# Altium project MC3_r2.PrjPcb (part 5 of 10)

## Sheet AD_Sensors.SchDoc
size Letter; DocumentNumber: D_11; SheetNumber: 11; SheetTotal: 21
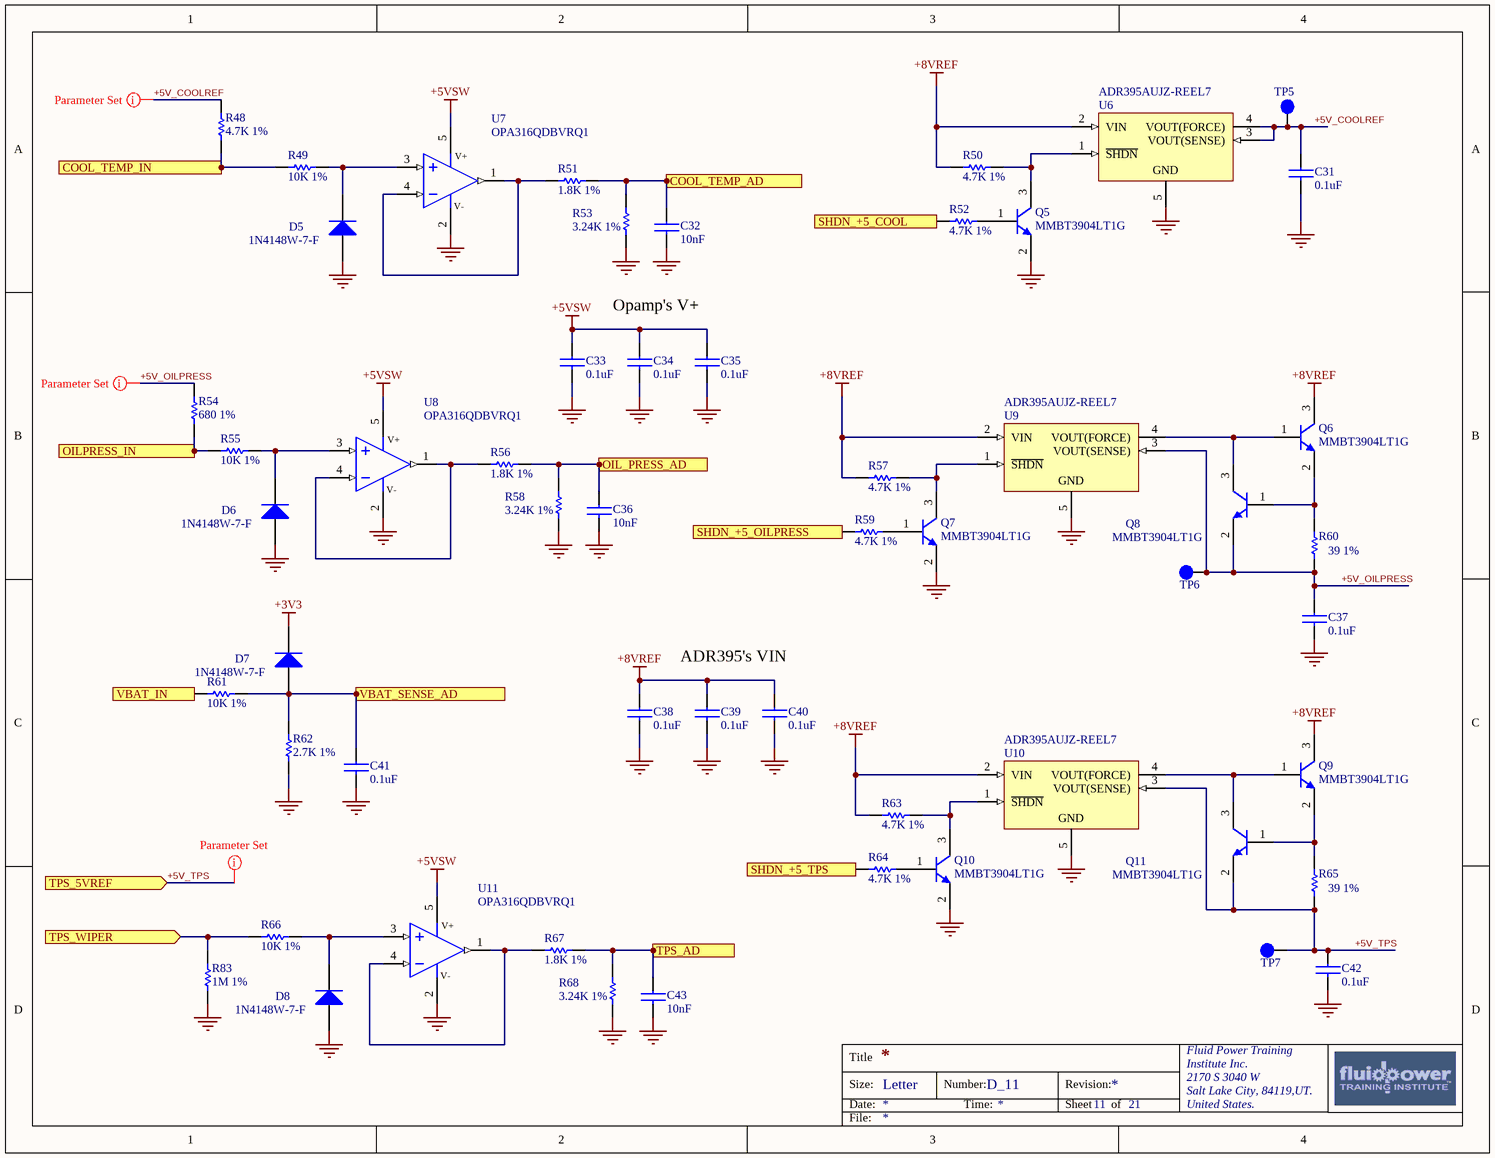
[diagram p8: AD_Sensors.SchDoc]

### Parts
C31  0.1uF  [C0805]
C32  10nF  [C0805]
C33  0.1uF  [C0805]
C34  0.1uF  [C0805]
C35  0.1uF  [C0805]
C36  10nF  [C0805]
C37  0.1uF  [C0805]
C38  0.1uF  [C0805]
C39  0.1uF  [C0805]
C40  0.1uF  [C0805]
C41  0.1uF  [C0805]
C42  0.1uF  [C0805]
C43  10nF  [C0805]
D5  1N4148W-7-F  [DIOD-SOD123-2_V]
D6  1N4148W-7-F  [DIOD-SOD123-2_V]
D7  1N4148W-7-F  [DIOD-SOD123-2_V]
D8  1N4148W-7-F  [DIOD-SOD123-2_V]
Q5  MMBT3904LT1G  [ONSC-SOT-23-3-318-08_V]
Q6  MMBT3904LT1G  [ONSC-SOT-23-3-318-08_V]
Q7  MMBT3904LT1G  [ONSC-SOT-23-3-318-08_V]
Q8  MMBT3904LT1G  [ONSC-SOT-23-3-318-08_V]
Q9  MMBT3904LT1G  [ONSC-SOT-23-3-318-08_V]
Q10  MMBT3904LT1G  [ONSC-SOT-23-3-318-08_V]
Q11  MMBT3904LT1G  [ONSC-SOT-23-3-318-08_V]
R48  4.7K 1%  [R0805]
R49  10K 1%  [R0805]
R50  4.7K 1%  [R0805]
R51  1.8K 1%  [R0805]
R52  4.7K 1%  [R0805]
R53  3.24K 1%  [R0805]
R54  680 1%  [R0805]
R55  10K 1%  [R0805]
R56  1.8K 1%  [R0805]
R57  4.7K 1%  [R0805]
R58  3.24K 1%  [R0805]
R59  4.7K 1%  [R0805]
R60  39 1%  [R0805]
R61  10K 1%  [R0805]
R62  2.7K 1%  [R0805]
R63  4.7K 1%  [R0805]
R64  4.7K 1%  [R0805]
R65  39 1%  [R0805]
R66  10K 1%  [R0805]
R67  1.8K 1%  [R0805]
R68  3.24K 1%  [R0805]
R83  1M 1%  [R0805]
TP5  T  [TESTPOINTSMD_1x1MM]  (value not drawn)  (no BOM)
TP6  T  [TESTPOINTSMD_1x1MM]  (value not drawn)  (no BOM)
TP7  T  [TESTPOINTSMD_1x1MM]  (value not drawn)  (no BOM)
U6  ADR395AUJZ-REEL7  [ADI-UJ-5_M]
U7  OPA316QDBVRQ1  [DBV0005A_M]
U8  OPA316QDBVRQ1  [DBV0005A_M]
U9  ADR395AUJZ-REEL7  [ADI-UJ-5_M]
U10  ADR395AUJZ-REEL7  [ADI-UJ-5_M]
U11  OPA316QDBVRQ1  [DBV0005A_M]

### Ports
COOL_TEMP_AD (out), COOL_TEMP_IN (in), OIL_PRESS_AD (out), OILPRESS_IN (in), SHDN_+5_COOL (in), SHDN_+5_OILPRESS (in), SHDN_+5_TPS (in), TPS_5VREF (in), TPS_AD (out), TPS_WIPER (in), VBAT_IN (in), VBAT_SENSE_AD (out)

### Nets
+3V3: D7.2(K)
+5VSW: C33.1 C34.1 C35.1 U7.5(V+) U8.5(V+) U11.5(V+)
+8VREF: C38.1 C39.1 C40.1 Q6.3(C) Q9.3(C) R50.1 R57.1 R63.1 U6.2(VIN) U9.2(VIN) U10.2(VIN)
GND: C31.2 C32.2 C33.2 C34.2 C35.2 C36.2 C37.2 C38.2 C39.2 C40.2 C41.2 C42.2 C43.2 D5.1(A) D6.1(A) D8.1(A) Q5.2(E) Q7.2(E) Q10.2(E) R53.1 R58.1 R62.1 R68.1 R83.1 U6.5(GND) U7.2(V-) U8.2(V-) U9.5(GND) U10.5(GND) U11.2(V-)
+5V_COOLREF: C31.1 R48.2 TP5.1 U6.3(VOUT(SENSE)) U6.4(VOUT(FORCE))  [project net +5V_COOLREF_11]
+5V_OILPRESS: C37.1 Q8.2(E) R54.2 R60.1 TP6.1 U9.3(VOUT(SENSE))  [project net +5V_OILPRESS_11]
+5V_TPS: C42.1 Q11.2(E) R65.1 TP7.1 U10.3(VOUT(SENSE)) ; port TPS_5VREF  [project net TPS_5VREF]
COOL_AD: C32.1 R51.2 R53.2 ; port COOL_TEMP_AD
COOL_TEMP_IN: R48.1 R49.1 ; port COOL_TEMP_IN
OIL_PRESS_IN: R54.1 R55.1 ; port OILPRESS_IN
OILPRESSAD: C36.1 R56.2 R58.2 ; port OIL_PRESS_AD
SHDN_COOL: R52.1 ; port SHDN_+5_COOL
SHDN_OIL: R59.1 ; port SHDN_+5_OILPRESS
SHDN_TPS: R64.1 ; port SHDN_+5_TPS
TPS_WIPER: R66.1 R83.2 ; port TPS_WIPER
TPSAD: C43.1 R67.2 R68.2 ; port TPS_AD
VBATS_AD: C41.1 D7.1(A) R61.2 R62.2 ; port VBAT_SENSE_AD
VBATT_: R61.1 ; port VBAT_IN
NetD5_2: D5.2(K) R49.2 U7.3(IN+)
NetD6_2: D6.2(K) R55.2 U8.3(IN+)
NetD8_2: D8.2(K) R66.2 U11.3(IN+)
NetQ5_1: Q5.1(B) R52.2
NetQ5_3: Q5.3(C) R50.2 U6.1(~{SHDN})
NetQ6_1: Q6.1(B) Q8.3(C) U9.4(VOUT(FORCE))
NetQ6_2: Q6.2(E) Q8.1(B) R60.2
NetQ7_1: Q7.1(B) R59.2
NetQ7_3: Q7.3(C) R57.2 U9.1(~{SHDN})
NetQ9_1: Q9.1(B) Q11.3(C) U10.4(VOUT(FORCE))
NetQ9_2: Q9.2(E) Q11.1(B) R65.2
NetQ10_1: Q10.1(B) R64.2
NetQ10_3: Q10.3(C) R63.2 U10.1(~{SHDN})
NetR51_1: R51.1 U7.1(OUT) U7.4(IN-)
NetR56_1: R56.1 U8.1(OUT) U8.4(IN-)
NetR67_1: R67.1 U11.1(OUT) U11.4(IN-)

### Layout directives
net class VREF: +5V_COOLREF_11, +5V_OILPRESS_11, TPS_5VREF

### Notes on the sheet
- Opamp's V+
- ADR395's VIN
- Title
- Size:
- Date:
- Letter
- Number:
- Time:
- Revision:
- Sheet
- of
- Fluid Power Training
- Institute Inc.
- 2170 S 3040 W
- Salt Lake City, 84119,UT.
- United States.
- File:

### Library data of the parts
C31 C33-C35 C37-C42 = C0805C104K5RACTU: Cap Ceramic 0.1uF 50V X7R 10% SMD 2.0 x 1.2 mm 125 C Paper T/R; Manufacturer: KEMET; Capacitance: 100nF; Voltage: 500V; Supplier 1: Mouser; Supplier Part Number 1: 80-C0805C104K5R; Manufacturer Part Number: C0805C104K5RACTU; RoHS: Yes; Category: Ceramic Capacitors; Stock 1: 4177670; Pricing 1: 1=0.17000, 10=0.10400, 100=0.05600, 500=0.03900, 1000=0.03200, 4000=0.02400 (USD); Mount: Surface Mount,PCB; Case/Package: 0805; Number of Pins: 2; Case Code (Imperial): 0805; Case Code (Metric): 2012; Dielectric Material: Ceramic; Contact Plating: Tin,Matte; Min Operating Temperature: -55°C; Max Operating Temperature: 125°C; Voltage Rating: 50V; Tolerance: 10%; Packaging: Tape and Reel; Dielectric: X7R; Package Quantity: 4000; Voltage Rating (DC): 50V; Termination: SMD/SMT; Length: 2mm; Height: 0.9mm; Width: 1.2mm; Depth: 1.25mm; Thickness: 0.035inch; Lead Pitch: 0.75mm; Radiation Hardening: No; REACH SVHC: No SVHC; ComponentLink1URL: https://datasheet.ciiva.com/14589/70095383-14589048.pdf?src-supplier=Allied+Electronics; ComponentLink1Description: https://datasheet.ciiva.com/14589/70095383-14589048.pdf?src-supplier=Allied+Electronics; ComponentLink2URL: https://datasheet.ciiva.com/28682/1851736-28682232.pdf?src-supplier=Element14; ComponentLink2Description: https://datasheet.ciiva.com/28682/1851736-28682232.pdf?src-supplier=Element14; ComponentLink3URL: https://datasheet.ciiva.com/32431/slceramic-chip-condensers-e-32431755.pdf?src-supplier=Distrelec; ComponentLink3Description: https://datasheet.ciiva.com/32431/slceramic-chip-condensers-e-32431755.pdf?src-supplier=Distrelec; ComponentLink4URL: https://datasheet.ciiva.com/18410/70095383-18410815.pdf?src-supplier=Allied+Electronics; ComponentLink4Description: https://datasheet.ciiva.com/18410/70095383-18410815.pdf?src-supplier=Allied+Electronics
C32 C36 C43 = CC0805KRX7R9BB103: YAGEO - CC0805KRX7R9BB103 - SMD Multilayer Ceramic Capacitor, 10000 pF, 50 V, 0805 [2012 Metric], ± 10%, X7R, CC Series; Voltage Rating: 50V; Insulation Resistance: 100GR; Supplier 1: Mouser; Supplier Part Number 1: 603-CC805KRX7R9BB103; Manufacturer: Yageo; Manufacturer Part Number: CC0805KRX7R9BB103; RoHS: Yes; Category: Ceramic Capacitors; Stock 1: 473100; Pricing 1: 1=0.11000, 10=0.05700, 100=0.02600, 1000=0.02100, 4000=0.01600, 8000=0.01400 (USD); Mount: Surface Mount; Case/Package: 0805; Number of Pins: 2; Case Code (Imperial): 0805; Case Code (Metric): 2012; Material: Ceramic; Min Operating Temperature: -55°C; Max Operating Temperature: 125°C; Packaging: Tape and Reel; Capacitance: 10nF; Tolerance: 10%; Package Quantity: 1; Dielectric: X7R; Termination: SMD/SMT; Voltage Rating (DC): 50V; Voltage: 50V; Composition: Ceramic; Length: 2mm; Height: 0.6mm; Width: 1.25mm; Depth: 1.25mm; Thickness: 0.024inch; Radiation Hardening: No; REACH SVHC: No SVHC; Lead Free: Lead Free; Halogen Free: Halogen Free; ComponentLink1URL: https://datasheet.ciiva.com/11786/0900766b80d84f1d-11786119.pdf?src-supplier=RSComponents; ComponentLink1Description: https://datasheet.ciiva.com/11786/0900766b80d84f1d-11786119.pdf?src-supplier=RSComponents; ComponentLink2URL: https://datasheet.ciiva.com/25613/0900766b8027bcf6-25613113.pdf?src-supplier=RSComponents; ComponentLink2Description: https://datasheet.ciiva.com/25613/0900766b8027bcf6-25613113.pdf?src-supplier=RSComponents; ComponentLink3URL: https://datasheet.ciiva.com/144/mlccorderingcode-144533.pdf?src-supplier=Digi-Key; ComponentLink3Description: https://datasheet.ciiva.com/144/mlccorderingcode-144533.pdf?src-supplier=Digi-Key; ComponentLink4URL: https://datasheet.ciiva.com/144/mlccorderingcode-144534.pdf?src-supplier=Digi-Key; ComponentLink4Description: https://datasheet.ciiva.com/144/mlccorderingcode-144534.pdf?src-supplier=Digi-Key; ComponentLink5URL: https://datasheet.ciiva.com/46372/1784427-46372638.pdf?src-supplier=Element14; ComponentLink5Description: https://datasheet.ciiva.com/46372/1784427-46372638.pdf?src-supplier=Element14; ComponentLink6URL: https://datasheet.ciiva.com/144/mlccorderingcode-144532.pdf?src-supplier=Digi-Key; ComponentLink6Description: https://datasheet.ciiva.com/144/mlccorderingcode-144532.pdf?src-supplier=Digi-Key; ComponentLink7URL: https://datasheet.ciiva.com/16625/upy-gphc-x7r-6-3v-to-50v-8-16625548.pdf?src-supplier=Avnet+Europe; ComponentLink7Description: https://datasheet.ciiva.com/16625/upy-gphc-x7r-6-3v-to-50v-8-16625548.pdf?src-supplier=Avnet+Europe; ComponentLink8URL: https://datasheet.ciiva.com/22749/1489800-22749215.pdf?src-supplier=Element14; ComponentLink8Description: https://datasheet.ciiva.com/22749/1489800-22749215.pdf?src-supplier=Element14; ComponentLink9URL: https://datasheet.ciiva.com/46372/1734573-46372639.pdf?src-supplier=Element14; ComponentLink9Description: https://datasheet.ciiva.com/46372/1734573-46372639.pdf?src-supplier=Element14
D5-D8 = 1N4148W-7-F: DIODE GEN PURP 100V 300MA SOD123; Manufacturer: Diodes; Reverse Recovery Time: 4ns; Forward Voltage: 1.25V; Element Configuration: Single; Forward Current: 150mA; Peak Non-Repetitive Surge Current: 2A; Power Dissipation: 400mW; Peak Reverse Current: 1uA; Polarity: Standard; Voltage Rating (DC): 75V; Capacitance: 2pF; Current: 15A; Supplier 1: Mouser; Supplier Part Number 1: 621-1N4148W-F; Manufacturer Part Number: 1N4148W-7-F; RoHS: Yes; Category: Rectifier Diodes; Stock 1: 1274151; Pricing 1: 1=0.16000, 10=0.15000, 100=0.05300, 1000=0.03500, 3000=0.02700, 9000=0.02400 (USD); Mount: Surface Mount; Number of Pins: 2; Weight: 0.000353oz; Contact Plating: Tin,Matte; Min Operating Temperature: -65°C; Max Operating Temperature: 150°C; Packaging: Tape and Reel; Max Repetitive Reverse Voltage (Vrrm): 100V; Package Quantity: 3000; Average Rectified Current: 300mA; Max Reverse Voltage (DC): 100V; Recovery Time: 4ns; Max Forward Surge Current (Ifsm): 2A; Max Surge Current: 2A; Current Rating: 150mA; Output Current: 150mA; Voltage: 100V; Power Rating: 400mW; Length: 2.85mm; Height: 1.25mm; Width: 1.7mm; Radiation Hardening: No; Lead Free: Lead Free; REACH SVHC: No SVHC; ComponentLink1URL: https://datasheet.ciiva.com/4435/ds30086-4435128.pdf?src-supplier=Mouser; ComponentLink1Description: https://datasheet.ciiva.com/4435/ds30086-4435128.pdf?src-supplier=Mouser; ComponentLink2URL: https://datasheet.ciiva.com/8300/ds30086-8300392.pdf?src-supplier=Avnet; ComponentLink2Description: https://datasheet.ciiva.com/8300/ds30086-8300392.pdf?src-supplier=Avnet; ComponentLink3URL: https://datasheet.ciiva.com/911/ds30086-911734.pdf?src-supplier=Digi-Key; ComponentLink3Description: https://datasheet.ciiva.com/911/ds30086-911734.pdf?src-supplier=Digi-Key; ComponentLink4URL: https://datasheet.ciiva.com/911/ds30086-911735.pdf?src-supplier=Digi-Key; ComponentLink4Description: https://datasheet.ciiva.com/911/ds30086-911735.pdf?src-supplier=Digi-Key; ComponentLink5URL: https://datasheet.ciiva.com/22695/1915529-22695239.pdf?src-supplier=Element14; ComponentLink5Description: https://datasheet.ciiva.com/22695/1915529-22695239.pdf?src-supplier=Element14; ComponentLink6URL: https://datasheet.ciiva.com/911/ds30086-911736.pdf?src-supplier=Digi-Key; ComponentLink6Description: https://datasheet.ciiva.com/911/ds30086-911736.pdf?src-supplier=Digi-Key; ComponentLink7URL: https://datasheet.ciiva.com/1179/1915529-1179304.pdf?src-supplier=Element14; ComponentLink7Description: https://datasheet.ciiva.com/1179/1915529-1179304.pdf?src-supplier=Element14; ComponentLink8URL: https://datasheet.ciiva.com/25919/ds30086-25919609.pdf?src-supplier=Avnet+Europe; ComponentLink8Description: https://datasheet.ciiva.com/25919/ds30086-25919609.pdf?src-supplier=Avnet+Europe; ComponentLink9URL: https://datasheet.ciiva.com/15219/getdatasheetpartid-110030-15219548.pdf?src-supplier=Verical; ComponentLink9Description: https://datasheet.ciiva.com/15219/getdatasheetpartid-110030-15219548.pdf?src-supplier=Verical; ComponentLink10URL: https://datasheet.ciiva.com/8303/ds30086-8303197.pdf?src-supplier=Avnet; ComponentLink10Description: https://datasheet.ciiva.com/8303/ds30086-8303197.pdf?src-supplier=Avnet
Q5-Q11 = MMBT3904LT1G: ON Semi MMBT3904LT1G NPN Bipolar Transistor, 0.2 A, 40 V, 3-Pin SOT-23; Manufacturer: ON Semiconductor; Collector Emitter Breakdown Voltage: 40V; Max Power Dissipation: 300mW; Max Collector Current: 200mA; Collector Base Voltage (VCBO): 60V; Emitter Base Voltage (VEBO): 6V; Element Configuration: Single; Transition Frequency: 300MHz; Collector Emitter Saturation Voltage: 300mV; hFE Min: 100; Number of Elements: 1; Type: General Purpose; Supplier 1: Mouser; Supplier Part Number 1: 863-MMBT3904LT1G; Manufacturer Part Number: MMBT3904LT1G; RoHS: Yes; Category: BJTs; Stock 1: 753014; Pricing 1: 1=0.12000, 10=0.10900, 100=0.03800, 1000=0.02500, 3000=0.01900, 9000=0.01700 (USD); Case/Package: SOT-23-3; Number of Pins: 3; Contact Plating: Tin,Matte; Min Operating Temperature: -55°C; Max Operating Temperature: 150°C; Packaging: Tape and Reel; Polarity: NPN; Collector Emitter Voltage (VCEO): 40V; Package Quantity: 1; Gain Bandwidth Product: 300MHz; Power Dissipation: 300mW; Max Breakdown Voltage: 40V; Voltage Rating (DC): 40V; Current Rating: 200mA; Frequency: 300MHz; Max Frequency: 300MHz; Length: 2.9mm; Height: 0.94mm; Width: 1.3mm; Radiation Hardening: No; Lead Free: Lead Free; REACH SVHC: No SVHC; ComponentLink1URL: https://datasheet.ciiva.com/16199/mmbt3904lt1-d-16199009.pdf?src-supplier=Future+Electronics; ComponentLink1Description: https://datasheet.ciiva.com/16199/mmbt3904lt1-d-16199009.pdf?src-supplier=Future+Electronics; ComponentLink2URL: https://datasheet.ciiva.com/4723/mmbt3904lt1-d-113169-4723050.pdf?src-supplier=Mouser; ComponentLink2Description: https://datasheet.ciiva.com/4723/mmbt3904lt1-d-113169-4723050.pdf?src-supplier=Mouser; ComponentLink3URL: https://datasheet.ciiva.com/15138/getdatasheetpartid-53263-15138779.pdf?src-supplier=Verical; ComponentLink3Description: https://datasheet.ciiva.com/15138/getdatasheetpartid-53263-15138779.pdf?src-supplier=Verical; ComponentLink4URL: https://datasheet.ciiva.com/976/mmbt3904lt1-d-976362.pdf?src-supplier=Digi-Key; ComponentLink4Description: https://datasheet.ciiva.com/976/mmbt3904lt1-d-976362.pdf?src-supplier=Digi-Key; ComponentLink5URL: https://datasheet.ciiva.com/16478/mmbt3904lt1-d-16478538.pdf?src-supplier=Avnet+Asia; ComponentLink5Description: https://datasheet.ciiva.com/16478/mmbt3904lt1-d-16478538.pdf?src-supplier=Avnet+Asia; ComponentLink6URL: https://datasheet.ciiva.com/976/mmbt3904lt1-d-976363.pdf?src-supplier=Digi-Key; ComponentLink6Description: https://datasheet.ciiva.com/976/mmbt3904lt1-d-976363.pdf?src-supplier=Digi-Key; ComponentLink7URL: https://datasheet.ciiva.com/11199/mmbt3904lt1-d-11199003.pdf?src-supplier=Avnet; ComponentLink7Description: https://datasheet.ciiva.com/11199/mmbt3904lt1-d-11199003.pdf?src-supplier=Avnet; ComponentLink8URL: https://datasheet.ciiva.com/976/mmbt3904lt1-d-976364.pdf?src-supplier=Digi-Key; ComponentLink8Description: https://datasheet.ciiva.com/976/mmbt3904lt1-d-976364.pdf?src-supplier=Digi-Key; ComponentLink9URL: https://datasheet.ciiva.com/14546/70099530-14546188.pdf?src-supplier=Allied+Electronics; ComponentLink9Description: https://datasheet.ciiva.com/14546/70099530-14546188.pdf?src-supplier=Allied+Electronics; ComponentLink10URL: https://datasheet.ciiva.com/7972/1708269-7972381.pdf?src-supplier=Element14; ComponentLink10Description: https://datasheet.ciiva.com/7972/1708269-7972381.pdf?src-supplier=Element14; ComponentLink11URL: https://datasheet.ciiva.com/22664/1708269-22664159.pdf?src-supplier=Element14; ComponentLink11Description: https://datasheet.ciiva.com/22664/1708269-22664159.pdf?src-supplier=Element14
R48 R50 R52 R57 R59 R63 R64 = ERJ-6ENF4701V: 4.7 kohm, ERJ6E Serien, 150 V, Tjockfilm,PANASONIC - ERJ6ENF4701V - Ytmonterat chipmotstånd, Tjockfilm, 0805 [2012 Metrisk]; Resistance: 4.7kR; Temperature Coefficient: 100ppm/°C; Power Rating: 125mW; Voltage Rating: 150V; Supplier 1: Mouser; Supplier Part Number 1: 667-ERJ-6ENF4701V; Manufacturer: Panasonic; Manufacturer Part Number: ERJ-6ENF4701V; RoHS: Yes; Category: Chip SMD Resistors; Stock 1: 169380; Pricing 1: 1=0.13000, 10=0.07200, 100=0.06800, 500=0.06800, 1000=0.06800, 5000=0.01700 (USD); Mount: Surface Mount; Case/Package: 0805; Number of Pins: 2; Weight: 0.000194oz; Case Code (Metric): 2012; Case Code (Imperial): 0805; Contact Plating: Tin; Min Operating Temperature: -55°C; Max Operating Temperature: 155°C; Tolerance: 1%; Packaging: Tape and Reel; Composition: Thick Film; Voltage Rating (DC): 150V; Number of Terminations: 2; Termination: SMD/SMT; Max Power Dissipation: 125mW; Package Quantity: 1; Features: Automotive AEC-Q200; Military Standard: Not; Working Voltage: 150V; Length: 2mm; Height: 0.6mm; Width: 0.049inch; Depth: 1.25mm; Radiation Hardening: No; Lead Free: Lead Free; REACH SVHC: No SVHC; ComponentLink1URL: https://datasheet.ciiva.com/11821/0900766b80f80784-11821673.pdf?src-supplier=RSComponents; ComponentLink1Description: https://datasheet.ciiva.com/11821/0900766b80f80784-11821673.pdf?src-supplier=RSComponents; ComponentLink2URL: https://datasheet.ciiva.com/28514/426256-28514229.pdf?src-supplier=Element14; ComponentLink2Description: https://datasheet.ciiva.com/28514/426256-28514229.pdf?src-supplier=Element14; ComponentLink3URL: https://datasheet.ciiva.com/16200/aoa0000ce2-16200217.pdf?src-supplier=Future+Electronics; ComponentLink3Description: https://datasheet.ciiva.com/16200/aoa0000ce2-16200217.pdf?src-supplier=Future+Electronics; ComponentLink4URL: https://datasheet.ciiva.com/7830/426256-7830750.pdf?src-supplier=Element14; ComponentLink4Description: https://datasheet.ciiva.com/7830/426256-7830750.pdf?src-supplier=Element14; ComponentLink5URL: https://datasheet.ciiva.com/16777/70260748-16777271.pdf?src-supplier=Allied+Electronics; ComponentLink5Description: https://datasheet.ciiva.com/16777/70260748-16777271.pdf?src-supplier=Allied+Electronics; ComponentLink6URL: https://datasheet.ciiva.com/9117/aoa0000ce2-9117307.pdf?src-supplier=Avnet; ComponentLink6Description: https://datasheet.ciiva.com/9117/aoa0000ce2-9117307.pdf?src-supplier=Avnet; ComponentLink7URL: https://datasheet.ciiva.com/16769/70260748-16769116.pdf?src-supplier=Allied+Electronics; ComponentLink7Description: https://datasheet.ciiva.com/16769/70260748-16769116.pdf?src-supplier=Allied+Electronics; ComponentLink8URL: https://datasheet.ciiva.com/24124/aoa0000ce2-24124253.pdf?src-supplier=Mouser; ComponentLink8Description: https://datasheet.ciiva.com/24124/aoa0000ce2-24124253.pdf?src-supplier=Mouser; ComponentLink9URL: https://datasheet.ciiva.com/22667/1678782-22667902.pdf?src-supplier=Element14; ComponentLink9Description: https://datasheet.ciiva.com/22667/1678782-22667902.pdf?src-supplier=Element14
R49 R55 R61 R66 = CRCW080510K0FKEA: VISHAY - CRCW080510K0FKEA - SMD Chip Resistor, 0805 [2012 Metric], 10 kohm, CRCW e3 Series, 150 V, Thick Film, 125 mW; Resistance: 10kR; Temperature Coefficient: 100ppm/°C; Power Rating: 125mW; Voltage Rating: 150V; Supplier 1: Mouser; Supplier Part Number 1: 71-CRCW0805-10K-E3; Manufacturer: Vishay; Manufacturer Part Number: CRCW080510K0FKEA; RoHS: Yes; Category: Chip SMD Resistors; Stock 1: 1138857; Pricing 1: 1=0.10000, 10=0.06200, 100=0.02500, 1000=0.01000, 5000=0.00700, 10000=0.00600 (USD); Case/Package: 0805; Weight: 0.000194oz; Case Code (Imperial): 0805; Case Code (Metric): 2012; Contact Plating: Tin; Min Operating Temperature: -55°C; Max Operating Temperature: 155°C; Tolerance: 1%; Packaging: Tape and Reel; Composition: Thick Film; Termination: SMD/SMT; Voltage Rating (DC): 150V; Package Quantity: 5000; Military Standard: Not; Length: 2mm; Height: 0.45mm; Width: 1.25mm; Depth: 1.25mm; Radiation Hardening: No; Lead Free: Lead Free; REACH SVHC: Unknown; ComponentLink1URL: https://datasheet.ciiva.com/11808/0900766b80d98b26-11808216.pdf?src-supplier=RSComponents; ComponentLink1Description: https://datasheet.ciiva.com/11808/0900766b80d98b26-11808216.pdf?src-supplier=RSComponents; ComponentLink2URL: https://datasheet.ciiva.com/5547/dcrcwe3-109170-5547559.pdf?src-supplier=Mouser; ComponentLink2Description: https://datasheet.ciiva.com/5547/dcrcwe3-109170-5547559.pdf?src-supplier=Mouser; ComponentLink3URL: https://datasheet.ciiva.com/16719/70201119-16719082.pdf?src-supplier=Allied+Electronics; ComponentLink3Description: https://datasheet.ciiva.com/16719/70201119-16719082.pdf?src-supplier=Allied+Electronics; ComponentLink4URL: https://datasheet.ciiva.com/16883/dcrcwe3-16883708.pdf?src-supplier=Avnet+Europe; ComponentLink4Description: https://datasheet.ciiva.com/16883/dcrcwe3-16883708.pdf?src-supplier=Avnet+Europe; ComponentLink5URL: https://datasheet.ciiva.com/8337/dcrcwe3-8337773.pdf?src-supplier=Avnet; ComponentLink5Description: https://datasheet.ciiva.com/8337/dcrcwe3-8337773.pdf?src-supplier=Avnet; ComponentLink6URL: https://datasheet.ciiva.com/46394/1720486-46394381.pdf?src-supplier=Element14; ComponentLink6Description: https://datasheet.ciiva.com/46394/1720486-46394381.pdf?src-supplier=Element14; ComponentLink7URL: https://datasheet.ciiva.com/16199/dcrcwe3-16199086.pdf?src-supplier=Future+Electronics; ComponentLink7Description: https://datasheet.ciiva.com/16199/dcrcwe3-16199086.pdf?src-supplier=Future+Electronics; ComponentLink8URL: https://datasheet.ciiva.com/16514/dcrcwe3-16514907.pdf?src-supplier=Avnet+Asia; ComponentLink8Description: https://datasheet.ciiva.com/16514/dcrcwe3-16514907.pdf?src-supplier=Avnet+Asia; ComponentLink9URL: https://datasheet.ciiva.com/16755/70201119-16755389.pdf?src-supplier=Allied+Electronics; ComponentLink9Description: https://datasheet.ciiva.com/16755/70201119-16755389.pdf?src-supplier=Allied+Electronics; ComponentLink10URL: https://datasheet.ciiva.com/8337/dcrcwe3-8337774.pdf?src-supplier=Avnet; ComponentLink10Description: https://datasheet.ciiva.com/8337/dcrcwe3-8337774.pdf?src-supplier=Avnet
R51 R56 R67 = ERJ-6ENF1801V: RESISTOR, 0805, 0.125W, 1%, 1K8; Manufacturer: Panasonic; Resistance: 1.8kR; Temperature Coefficient: 100ppm/°C; Voltage Rating: 150V; Power Rating: 125mW; Supplier 1: Mouser; Supplier Part Number 1: 667-ERJ-6ENF1801V; Manufacturer Part Number: ERJ-6ENF1801V; RoHS: Yes; Category: Chip SMD Resistors; Stock 1: 1306; Pricing 1: 1=0.12000, 10=0.08900, 100=0.03500, 1000=0.01700, 5000=0.01700, 10000=0.01700 (USD); Mount: Surface Mount; Case/Package: 0805; Number of Pins: 2; Case Code (Metric): 2012; Case Code (Imperial): 0805; Contact Plating: Tin; Min Operating Temperature: -55°C; Max Operating Temperature: 155°C; Packaging: Tape and Reel; Tolerance: 1%; Composition: Thick Film; Package Quantity: 1; Number of Terminations: 2; Max Power Dissipation: 125mW; Termination: SMD/SMT; Voltage Rating (DC): 150V; Features: Automotive AEC-Q200; Military Standard: Not; Length: 2mm; Height: 0.6mm; Width: 0.049inch; Depth: 1.25mm; REACH SVHC: No SVHC; ComponentLink1URL: https://datasheet.ciiva.com/11821/0900766b80f80784-11821574.pdf?src-supplier=RSComponents; ComponentLink1Description: https://datasheet.ciiva.com/11821/0900766b80f80784-11821574.pdf?src-supplier=RSComponents; ComponentLink2URL: https://datasheet.ciiva.com/17214/aoa0000ce2-17214517.pdf?src-supplier=Avnet+Europe; ComponentLink2Description: https://datasheet.ciiva.com/17214/aoa0000ce2-17214517.pdf?src-supplier=Avnet+Europe; ComponentLink3URL: https://datasheet.ciiva.com/7887/426256-7887030.pdf?src-supplier=Element14; ComponentLink3Description: https://datasheet.ciiva.com/7887/426256-7887030.pdf?src-supplier=Element14; ComponentLink4URL: https://datasheet.ciiva.com/16763/70260748-16763351.pdf?src-supplier=Allied+Electronics; ComponentLink4Description: https://datasheet.ciiva.com/16763/70260748-16763351.pdf?src-supplier=Allied+Electronics; ComponentLink5URL: https://datasheet.ciiva.com/22673/1678782-22673704.pdf?src-supplier=Element14; ComponentLink5Description: https://datasheet.ciiva.com/22673/1678782-22673704.pdf?src-supplier=Element14; ComponentLink6URL: https://datasheet.ciiva.com/46420/1678782-46420328.pdf?src-supplier=Element14; ComponentLink6Description: https://datasheet.ciiva.com/46420/1678782-46420328.pdf?src-supplier=Element14; ComponentLink7URL: https://datasheet.ciiva.com/16512/aoa0000ce2-16512137.pdf?src-supplier=Avnet+Asia; ComponentLink7Description: https://datasheet.ciiva.com/16512/aoa0000ce2-16512137.pdf?src-supplier=Avnet+Asia; ComponentLink8URL: https://datasheet.ciiva.com/6138/426256-6138778.pdf?src-supplier=Farnell; ComponentLink8Description: https://datasheet.ciiva.com/6138/426256-6138778.pdf?src-supplier=Farnell; ComponentLink9URL: https://datasheet.ciiva.com/16760/70260748-16760811.pdf?src-supplier=Allied+Electronics; ComponentLink9Description: https://datasheet.ciiva.com/16760/70260748-16760811.pdf?src-supplier=Allied+Electronics; ComponentLink10URL: https://datasheet.ciiva.com/24024/aoa0000ce2-24024172.pdf?src-supplier=Mouser; ComponentLink10Description: https://datasheet.ciiva.com/24024/aoa0000ce2-24024172.pdf?src-supplier=Mouser; ComponentLink11URL: https://datasheet.ciiva.com/7886/426256-7886751.pdf?src-supplier=Element14; ComponentLink11Description: https://datasheet.ciiva.com/7886/426256-7886751.pdf?src-supplier=Element14; ComponentLink12URL: https://datasheet.ciiva.com/30154/aoa0000ce2-30154047.pdf?src-supplier=Onlinecomponents.com; ComponentLink12Description: https://datasheet.ciiva.com/30154/aoa0000ce2-30154047.pdf?src-supplier=Onlinecomponents.com
R53 R58 R68 = CRCW08053K24FKEA: VISHAY DRALORIC 	   	CRCW08053K24FKEA 	   	RES, THICK FILM, 3K24, 1%, 125MW, 0805; Resistance: 3.24kR; Temperature Coefficient: 100ppm/°C; Voltage Rating: 150V; Supplier 1: Mouser; Supplier Part Number 1: 71-CRCW0805-3.24K-E3; Manufacturer: Vishay; Manufacturer Part Number: CRCW08053K24FKEA; RoHS: Yes; Category: Chip SMD Resistors; Stock 1: 18434; Pricing 1: 1=0.10000, 10=0.06200, 100=0.02500, 1000=0.01000, 5000=0.00700, 10000=0.00600 (USD); Case/Package: 0805; Number of Pins: 2; Weight: 0.000194oz; Case Code (Imperial): 0805; Case Code (Metric): 2012; Contact Plating: Tin; Min Operating Temperature: -55°C; Max Operating Temperature: 155°C; Tolerance: 1%; Packaging: Tape and Reel; Composition: Thick Film; Number of Terminations: 2; Package Quantity: 10; Max Power Dissipation: 125mW; Power Rating: 125mW; Termination: Solder; Voltage Rating (DC): 150V; Features: Automotive AEC-Q200; Military Standard: Not; Length: 2mm; Height: 0.02inch; Width: 1.25mm; Depth: 1.25mm; Radiation Hardening: No; Lead Free: Lead Free; REACH SVHC: Unknown; ComponentLink1URL: https://datasheet.ciiva.com/9080/dcrcwe3-9080725.pdf?src-supplier=Avnet; ComponentLink1Description: https://datasheet.ciiva.com/9080/dcrcwe3-9080725.pdf?src-supplier=Avnet; ComponentLink2URL: https://datasheet.ciiva.com/16783/70201119-16783896.pdf?src-supplier=Allied+Electronics; ComponentLink2Description: https://datasheet.ciiva.com/16783/70201119-16783896.pdf?src-supplier=Allied+Electronics; ComponentLink3URL: https://datasheet.ciiva.com/2496/dcrcwe3-2496042.pdf?src-supplier=Digi-Key; ComponentLink3Description: https://datasheet.ciiva.com/2496/dcrcwe3-2496042.pdf?src-supplier=Digi-Key; ComponentLink4URL: https://datasheet.ciiva.com/7670/1533075-7670379.pdf?src-supplier=Element14; ComponentLink4Description: https://datasheet.ciiva.com/7670/1533075-7670379.pdf?src-supplier=Element14; ComponentLink5URL: https://datasheet.ciiva.com/7670/1697337-7670300.pdf?src-supplier=Element14; ComponentLink5Description: https://datasheet.ciiva.com/7670/1697337-7670300.pdf?src-supplier=Element14; ComponentLink6URL: https://datasheet.ciiva.com/2496/dcrcwe3-2496040.pdf?src-supplier=Digi-Key; ComponentLink6Description: https://datasheet.ciiva.com/2496/dcrcwe3-2496040.pdf?src-supplier=Digi-Key; ComponentLink7URL: https://datasheet.ciiva.com/2496/dcrcwe3-2496041.pdf?src-supplier=Digi-Key; ComponentLink7Description: https://datasheet.ciiva.com/2496/dcrcwe3-2496041.pdf?src-supplier=Digi-Key
R54 = ERJ6ENF6800V: 680 ohm, 125 mW,  1%, 150 V,PANASONIC ELECTRONIC COMPONENTS         ERJ6ENF6800V            Surface Mount Chip Resistor, Thick Film, AEC-Q200 ERJ6E Series,; Resistance: 680R; Temperature Coefficient: 100ppm/°C; Power Rating: 125mW; Voltage Rating: 150V; Supplier 1: Mouser; Supplier Part Number 1: 667-ERJ-6ENF6800V; Manufacturer: Panasonic; Manufacturer Part Number: ERJ6ENF6800V; RoHS: Yes; Category: Chip SMD Resistors; Stock 1: 59996; Pricing 1: 1=0.11000, 10=0.07200, 100=0.02800, 1000=0.01900, 5000=0.01700, 10000=0.01500 (USD); Mount: Surface Mount; Case/Package: 0805; Number of Pins: 2; Case Code (Metric): 2012; Case Code (Imperial): 0805; Contact Plating: Tin; Min Operating Temperature: -55°C; Max Operating Temperature: 155°C; Tolerance: 1%; Packaging: Tape and Reel; Composition: Thick Film; Number of Terminations: 2; Termination: SMD/SMT; Max Power Dissipation: 125mW; Package Quantity: 1; Features: Automotive AEC-Q200; Military Standard: Not; Length: 2mm; Height: 0.6mm; Width: 0.049inch; Depth: 1.25mm; Radiation Hardening: No; REACH SVHC: No SVHC; ComponentLink1URL: https://datasheet.ciiva.com/11821/0900766b80f80784-11821688.pdf?src-supplier=RSComponents; ComponentLink1Description: https://datasheet.ciiva.com/11821/0900766b80f80784-11821688.pdf?src-supplier=RSComponents; ComponentLink2URL: https://datasheet.ciiva.com/16787/70260748-16787589.pdf?src-supplier=Allied+Electronics; ComponentLink2Description: https://datasheet.ciiva.com/16787/70260748-16787589.pdf?src-supplier=Allied+Electronics; ComponentLink3URL: https://datasheet.ciiva.com/9180/aoa0000ce2-9180429.pdf?src-supplier=Avnet; ComponentLink3Description: https://datasheet.ciiva.com/9180/aoa0000ce2-9180429.pdf?src-supplier=Avnet; ComponentLink4URL: https://datasheet.ciiva.com/7944/426256-7944661.pdf?src-supplier=Element14; ComponentLink4Description: https://datasheet.ciiva.com/7944/426256-7944661.pdf?src-supplier=Element14; ComponentLink5URL: https://datasheet.ciiva.com/16512/aoa0000ce2-16512058.pdf?src-supplier=Avnet+Asia; ComponentLink5Description: https://datasheet.ciiva.com/16512/aoa0000ce2-16512058.pdf?src-supplier=Avnet+Asia; ComponentLink6URL: https://datasheet.ciiva.com/16757/70260748-16757933.pdf?src-supplier=Allied+Electronics; ComponentLink6Description: https://datasheet.ciiva.com/16757/70260748-16757933.pdf?src-supplier=Allied+Electronics; ComponentLink7URL: https://datasheet.ciiva.com/30107/aoa0000ce2-30107005.pdf?src-supplier=Onlinecomponents.com; ComponentLink7Description: https://datasheet.ciiva.com/30107/aoa0000ce2-30107005.pdf?src-supplier=Onlinecomponents.com; ComponentLink8URL: https://datasheet.ciiva.com/46373/1678782-46373887.pdf?src-supplier=Element14; ComponentLink8Description: https://datasheet.ciiva.com/46373/1678782-46373887.pdf?src-supplier=Element14; ComponentLink9URL: https://datasheet.ciiva.com/17205/aoa0000ce2-17205287.pdf?src-supplier=Avnet+Europe; ComponentLink9Description: https://datasheet.ciiva.com/17205/aoa0000ce2-17205287.pdf?src-supplier=Avnet+Europe; ComponentLink10URL: https://datasheet.ciiva.com/7944/426256-7944953.pdf?src-supplier=Element14; ComponentLink10Description: https://datasheet.ciiva.com/7944/426256-7944953.pdf?src-supplier=Element14; ComponentLink11URL: https://datasheet.ciiva.com/5860/426256-5860698.pdf?src-supplier=Farnell; ComponentLink11Description: https://datasheet.ciiva.com/5860/426256-5860698.pdf?src-supplier=Farnell; ComponentLink12URL: https://datasheet.ciiva.com/46373/1678782-46373886.pdf?src-supplier=Element14; ComponentLink12Description: https://datasheet.ciiva.com/46373/1678782-46373886.pdf?src-supplier=Element14
R60 R65 = ERJ-6ENF39R0V: Res 39 Ohms;  Pwr-Rtg0.125 W;  Tol 1%;  SMT;  0805;  Tape & Reel; Manufacturer: Panasonic; Resistance: 39R; Temperature Coefficient: 100ppm/°C; Power Rating: 125mW; Voltage Rating: 150V; Supplier 1: Mouser; Supplier Part Number 1: 667-ERJ-6ENF39R0V; Manufacturer Part Number: ERJ-6ENF39R0V; RoHS: Yes; Category: Chip SMD Resistors; Stock 1: 48084; Pricing 1: 1=0.11000, 10=0.08900, 100=0.03500, 1000=0.02200, 5000=0.02200, 10000=0.02200 (USD); Mount: Surface Mount; Case/Package: 0805; Number of Pins: 2; Case Code (Metric): 2012; Case Code (Imperial): 0805; Contact Plating: Tin; Min Operating Temperature: -55°C; Max Operating Temperature: 155°C; Tolerance: 1%; Packaging: Tape and Reel; Composition: Thick Film; Number of Terminations: 2; Max Power Dissipation: 125mW; Termination: Solder; Package Quantity: 1; Voltage Rating (DC): 150V; Features: Automotive AEC-Q200; Military Standard: Not; Length: 2mm; Height: 0.6mm; Width: 0.049inch; Depth: 1.25mm; Radiation Hardening: No; REACH SVHC: No SVHC; ComponentLink1URL: https://datasheet.ciiva.com/24038/aoa0000ce2-24038777.pdf?src-supplier=Mouser; ComponentLink1Description: https://datasheet.ciiva.com/24038/aoa0000ce2-24038777.pdf?src-supplier=Mouser; ComponentLink2URL: https://datasheet.ciiva.com/7836/426256-7836826.pdf?src-supplier=Element14; ComponentLink2Description: https://datasheet.ciiva.com/7836/426256-7836826.pdf?src-supplier=Element14; ComponentLink3URL: https://datasheet.ciiva.com/9190/aoa0000ce2-9190012.pdf?src-supplier=Avnet; ComponentLink3Description: https://datasheet.ciiva.com/9190/aoa0000ce2-9190012.pdf?src-supplier=Avnet; ComponentLink4URL: https://datasheet.ciiva.com/22682/1678782-22682204.pdf?src-supplier=Element14; ComponentLink4Description: https://datasheet.ciiva.com/22682/1678782-22682204.pdf?src-supplier=Element14; ComponentLink5URL: https://datasheet.ciiva.com/7836/426256-7836541.pdf?src-supplier=Element14; ComponentLink5Description: https://datasheet.ciiva.com/7836/426256-7836541.pdf?src-supplier=Element14; ComponentLink6URL: https://datasheet.ciiva.com/16511/aoa0000ce2-16511949.pdf?src-supplier=Avnet+Asia; ComponentLink6Description: https://datasheet.ciiva.com/16511/aoa0000ce2-16511949.pdf?src-supplier=Avnet+Asia; ComponentLink7URL: https://datasheet.ciiva.com/16761/70260748-16761757.pdf?src-supplier=Allied+Electronics; ComponentLink7Description: https://datasheet.ciiva.com/16761/70260748-16761757.pdf?src-supplier=Allied+Electronics; ComponentLink8URL: https://datasheet.ciiva.com/5915/426256-5915343.pdf?src-supplier=Farnell; ComponentLink8Description: https://datasheet.ciiva.com/5915/426256-5915343.pdf?src-supplier=Farnell; ComponentLink9URL: https://datasheet.ciiva.com/16777/70260748-16777327.pdf?src-supplier=Allied+Electronics; ComponentLink9Description: https://datasheet.ciiva.com/16777/70260748-16777327.pdf?src-supplier=Allied+Electronics; ComponentLink10URL: https://datasheet.ciiva.com/22687/1678782-22687439.pdf?src-supplier=Element14; ComponentLink10Description: https://datasheet.ciiva.com/22687/1678782-22687439.pdf?src-supplier=Element14; ComponentLink11URL: https://datasheet.ciiva.com/30064/aoa0000ce2-30064223.pdf?src-supplier=Onlinecomponents.com; ComponentLink11Description: https://datasheet.ciiva.com/30064/aoa0000ce2-30064223.pdf?src-supplier=Onlinecomponents.com
R62 = AC0805FR-072K7L: RES SMD 2.7K OHM 1% 1/8W 0805; Manufacturer: Yageo; Resistance: 2.7kR; Temperature Coefficient: 100ppm/°C; Power Rating: 125mW; Voltage Rating: 150V; Supplier 1: Mouser; Supplier Part Number 1: 603-AC0805FR-072K7L; Manufacturer Part Number: AC0805FR-072K7L; RoHS: Yes; Category: Chip SMD Resistors; Stock 1: 3900; Pricing 1: 1=0.16000, 10=0.03700, 100=0.01300, 1000=0.01000, 5000=0.00600, 10000=0.00600 (USD); Case/Package: 0805; Case Code (Metric): 2012; Case Code (Imperial): 0805; Min Operating Temperature: -55°C; Max Operating Temperature: 155°C; Packaging: Tape and Reel; Tolerance: 1%; Composition: Thick Film; Termination: SMD/SMT; Number of Terminations: 2; Max Power Dissipation: 125mW; Features: Moisture Resistant,Automotive AEC-Q200; Length: 0.079inch; Height: 0.024inch; Width: 0.049inch; Lead Free: Lead Free; ComponentLink1URL: https://datasheet.ciiva.com/12656/pyu-ac-51-rohs-l-2-12656732.pdf?src-supplier=Mouser; ComponentLink1Description: https://datasheet.ciiva.com/12656/pyu-ac-51-rohs-l-2-12656732.pdf?src-supplier=Mouser
R83 = ERJ-6ENF1004V: Res Thick Film 0805 1M Ohm 1% 1/8W 100ppm/C Molded SMD Punched Carrier T/R; Manufacturer: Panasonic; Resistance: 1MR; Temperature Coefficient: 100ppm/°C; Power Rating: 125mW; Voltage Rating: 150V; Supplier 1: Mouser; Supplier Part Number 1: 667-ERJ-6ENF1004V; Manufacturer Part Number: ERJ-6ENF1004V; RoHS: Yes; Category: Chip SMD Resistors; Stock 1: 196038; Pricing 1: 1=0.10000, 10=0.07300, 100=0.02800, 1000=0.01700, 5000=0.01700, 10000=0.01700, 25000=0.01400, 50000=0.01000, 100000=0.00900 (USD); Mount: Surface Mount; Case/Package: 0805; Number of Pins: 2; Case Code (Imperial): 0805; Case Code (Metric): 2012; Contact Plating: Tin; Min Operating Temperature: -55°C; Max Operating Temperature: 155°C; Packaging: Tape and Reel; Tolerance: 1%; Composition: Thick Film; Package Quantity: 1; Termination: SMD/SMT; Number of Terminations: 2; Max Power Dissipation: 125mW; Voltage Rating (DC): 150V; Features: Automotive AEC-Q200; Military Standard: Not; Length: 2mm; Height: 0.6mm; Width: 1.2mm; Depth: 1.25mm; Radiation Hardening: No; Lead Free: Lead Free; REACH SVHC: No SVHC; ComponentLink1URL: https://datasheet.ciiva.com/11821/0900766b80f80784-11821573.pdf?src-supplier=RSComponents; ComponentLink1Description: https://datasheet.ciiva.com/11821/0900766b80f80784-11821573.pdf?src-supplier=RSComponents; ComponentLink2URL: https://datasheet.ciiva.com/16761/70260748-16761141.pdf?src-supplier=Allied+Electronics; ComponentLink2Description: https://datasheet.ciiva.com/16761/70260748-16761141.pdf?src-supplier=Allied+Electronics; ComponentLink3URL: https://datasheet.ciiva.com/22749/426256-22749637.pdf?src-supplier=Element14; ComponentLink3Description: https://datasheet.ciiva.com/22749/426256-22749637.pdf?src-supplier=Element14; ComponentLink4URL: https://datasheet.ciiva.com/30161/aoa0000ce2-30161525.pdf?src-supplier=Onlinecomponents.com; ComponentLink4Description: https://datasheet.ciiva.com/30161/aoa0000ce2-30161525.pdf?src-supplier=Onlinecomponents.com; ComponentLink5URL: https://datasheet.ciiva.com/48532/aoa0000ce2-48532149.pdf?src-supplier=Avnet; ComponentLink5Description: https://datasheet.ciiva.com/48532/aoa0000ce2-48532149.pdf?src-supplier=Avnet; ComponentLink6URL: https://datasheet.ciiva.com/8079/426256-8079622.pdf?src-supplier=Element14; ComponentLink6Description: https://datasheet.ciiva.com/8079/426256-8079622.pdf?src-supplier=Element14; ComponentLink7URL: https://datasheet.ciiva.com/27055/1988997-27055735.pdf?src-supplier=Jameco; ComponentLink7Description: https://datasheet.ciiva.com/27055/1988997-27055735.pdf?src-supplier=Jameco; ComponentLink8URL: https://datasheet.ciiva.com/5868/426256-5868184.pdf?src-supplier=Farnell; ComponentLink8Description: https://datasheet.ciiva.com/5868/426256-5868184.pdf?src-supplier=Farnell; ComponentLink9URL: https://datasheet.ciiva.com/46420/1678782-46420186.pdf?src-supplier=Element14; ComponentLink9Description: https://datasheet.ciiva.com/46420/1678782-46420186.pdf?src-supplier=Element14; ComponentLink10URL: https://datasheet.ciiva.com/16788/70260748-16788299.pdf?src-supplier=Allied+Electronics; ComponentLink10Description: https://datasheet.ciiva.com/16788/70260748-16788299.pdf?src-supplier=Allied+Electronics; ComponentLink11URL: https://datasheet.ciiva.com/7909/426256-7909229.pdf?src-supplier=Element14; ComponentLink11Description: https://datasheet.ciiva.com/7909/426256-7909229.pdf?src-supplier=Element14; ComponentLink12URL: https://datasheet.ciiva.com/15158/getdatasheetpartid-246555-15158845.pdf?src-supplier=Verical; ComponentLink12Description: https://datasheet.ciiva.com/15158/getdatasheetpartid-246555-15158845.pdf?src-supplier=Verical; ComponentLink13URL: https://datasheet.ciiva.com/16449/aoa0000ce2-16449407.pdf?src-supplier=Future+Electronics; ComponentLink13Description: https://datasheet.ciiva.com/16449/aoa0000ce2-16449407.pdf?src-supplier=Future+Electronics; ComponentLink14URL: https://datasheet.ciiva.com/17215/aoa0000ce2-17215247.pdf?src-supplier=Avnet+Europe; ComponentLink14Description: https://datasheet.ciiva.com/17215/aoa0000ce2-17215247.pdf?src-supplier=Avnet+Europe
TP5-TP7 = TestPoint_SMD_1x1: SMD Test Point
U6 U9 U10 = ADR395AUJZ-REEL7: ANALOG DEVICES - ADR395AUJZ-REEL7 - VOLTAGE REF, SERIES, 5V, TSOT-5; Max Output Current: 5mA; Max Input Voltage: 18V; Temperature Coefficient: 25ppm/°C; Tolerance: 0.12%; Operating Supply Current: 120uA; Output Type: Fixed; Supplier 1: Mouser; Supplier Part Number 1: 584-ADR395AUJZ-R7; Manufacturer: Analog Devices; Manufacturer Part Number: ADR395AUJZ-REEL7; RoHS: Yes; Category: Voltage References; Stock 1: 4513; Pricing 1: 1=2.26000, 10=2.03000, 25=1.92000, 100=1.54000, 250=1.34000, 500=1.30000 (USD); Case/Package: TSOT; Number of Pins: 5; Min Operating Temperature: -40°C; Max Operating Temperature: 125°C; Output Voltage: 5V; Packaging: Tape and Reel; Output Current: 5mA; Reference Type: Series; Min Output Voltage: 5V; Reference Voltage: 5V; Max Output Voltage: 5V; Radiation Hardening: No; REACH SVHC: No SVHC; Lead Free: Contains Lead; ComponentLink1URL: https://datasheet.ciiva.com/2008/adr391-392-395-2008665.pdf?src-supplier=Digi-Key; ComponentLink1Description: https://datasheet.ciiva.com/2008/adr391-392-395-2008665.pdf?src-supplier=Digi-Key; ComponentLink2URL: https://datasheet.ciiva.com/3237/adr391-392-395-3237061.pdf?src-supplier=Avnet; ComponentLink2Description: https://datasheet.ciiva.com/3237/adr391-392-395-3237061.pdf?src-supplier=Avnet; ComponentLink3URL: https://datasheet.ciiva.com/17218/adr391-392-395-17218677.pdf?src-supplier=Avnet+Europe; ComponentLink3Description: https://datasheet.ciiva.com/17218/adr391-392-395-17218677.pdf?src-supplier=Avnet+Europe; ComponentLink4URL: https://datasheet.ciiva.com/2008/adr391-392-395-2008663.pdf?src-supplier=Digi-Key; ComponentLink4Description: https://datasheet.ciiva.com/2008/adr391-392-395-2008663.pdf?src-supplier=Digi-Key; ComponentLink5URL: https://datasheet.ciiva.com/2008/adr391-392-395-2008664.pdf?src-supplier=Digi-Key; ComponentLink5Description: https://datasheet.ciiva.com/2008/adr391-392-395-2008664.pdf?src-supplier=Digi-Key
U7 U8 U11 = OPA316QDBVRQ1: Op Amp Single Low Power Amplifier R-R I/O ±2.75V/5.5V Automotive 5-Pin SOT-23 T/R; Manufacturer: Texas Instruments; Number of Circuits: 1; Slew Rate: 6V/µs; Gain Bandwidth Product: 10MHz; Input Bias Current: 5pA; Input Offset Voltage (Vos): 500uV; Operating Supply Current: 400uA; Output Current per Channel: 50mA; Supplier 1: Mouser; Supplier Part Number 1: 595-OPA316QDBVRQ1; Manufacturer Part Number: OPA316QDBVRQ1; RoHS: No; Category: Amplifiers - Op Amps, Buffer, Instrumentation; Stock 1: 4457; Pricing 1: 1=1.37000, 10=1.16000, 100=0.89100, 250=0.78700, 500=0.74600, 1000=0.58000 (USD); Mount: Surface Mount; Case/Package: SOT-23-5; Min Operating Temperature: -40°C; Max Operating Temperature: 125°C; Packaging: Tape and Reel; Number of Channels: 1; ComponentLink1URL: http://www.ti.com/lit/ds/symlink/opa316-q1.pdf?src-supplier=Digi-Key; ComponentLink1Description: http://www.ti.com/lit/ds/symlink/opa316-q1.pdf?src-supplier=Digi-Key